# EAGLE design zasilacz v2 (EAGLE 9.6.2)
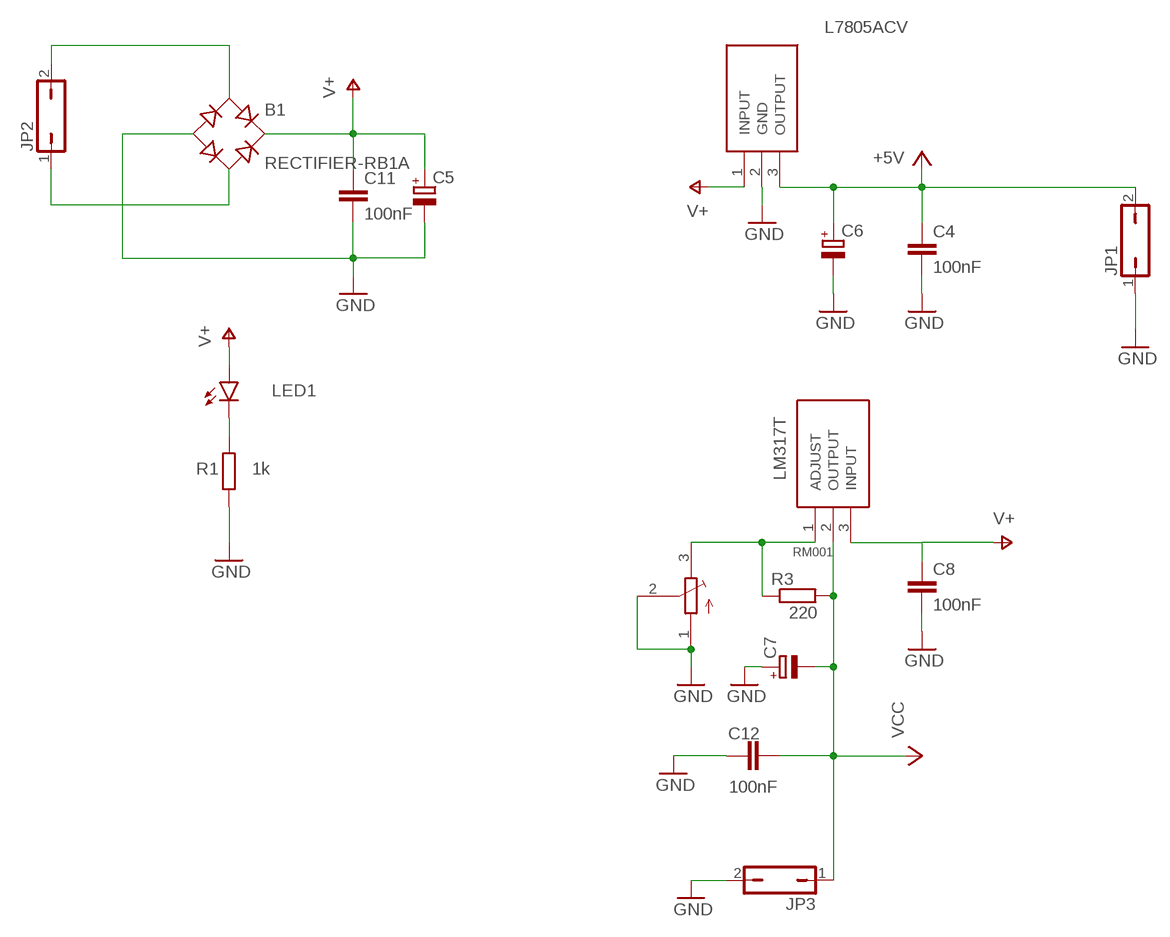
[diagram p0: schematic, sheet 1]

## Parts
,1  LM317T  [TO255P460X1020X2008-3P]
B1  RECTIFIER-RB1A  [RB1A]
C4  100nF  C-EU025-024X044  [C025-024X044]
C5  CPOL-EUE5-10.5  [E5-10,5]
C6  CPOL-EUE5-10.5  [E5-10,5]
C7  CPOL-EUE5-10.5  [E5-10,5]
C8  100nF  C-EU025-024X044  [C025-024X044]
C11  100nF  C-EU025-024X044  [C025-024X044]
C12  100nF  C-EU025-024X044  [C025-024X044]
IC1  L7805ACV  [TO255P460X1020X2008-3P]
JP1  JP1Q  [JP1]
JP2  JP1Q  [JP1]
JP3  JP1Q  [JP1]
LED1  TLLG4400  [LED3MM]
R1  1k  R-EU_0204/5  [0204/5]
R3  220  R-EU_0204/5  [0204/5]
RM001  RM065  [RM065]

## Nets
+5V: C4.1 C6.+ IC1.3(OUTPUT) JP1.2
GND: B1.- C4.2 C5.- C6.- C7.+ C8.2 C11.2 C12.1 IC1.2(GND) JP1.1 JP3.2 R1.1 RM001.1 RM001.2
N$1: LED1.K(C) R1.2
N$3: ,1.1(ADJUST) R3.1 RM001.3
N$5: B1.AC2 JP2.1
N$6: B1.AC1 JP2.2
V+: ,1.3(INPUT) B1.+ C5.+ C8.1 C11.1 IC1.1(INPUT) LED1.A
VCC: ,1.2(OUTPUT) C7.- C12.2 JP3.1 R3.2

## Library data of the parts
,1 = LM317T:LM317T: Standard Regulator 1.2V to 37V 1.5A STMicroelectronics LM317T, Single Linear Voltage Regulator, 1.5A Adjustable 1.2 37 V, 3-Pin TO-220 Source: Datasheet <http://www.st.com/web/en/resource/technical/document/datasheet/CD00000455.pdf>; DESCRIPTION: Standard Regulator 1.2V to 37V 1.5A STMicroelectronics LM317T, Single Linear Voltage Regulator, 1.5A Adjustable 1.2 37 V, 3-Pin TO-220; HEIGHT: 4.6mm; MANUFACTURER_NAME: STMicroelectronics; MANUFACTURER_PART_NUMBER: LM317T; MOUSER_PART_NUMBER: 511-LM317T; MOUSER_PRICE-STOCK: https://www.mouser.co.uk/ProductDetail/STMicroelectronics/LM317T?qs=swDD%252BF%252Bps7c8uLyY%252B3mJJw%3D%3D
B1 = rectifier:RECTIFIER-: Rectifier
C4 C8 C11 C12 = rcl:C-EU: CAPACITOR, European symbol; SPICEPREFIX: C
C5-C7 = rcl:CPOL-EU: POLARIZED CAPACITOR, European symbol; SPICEPREFIX: C
IC1 = L7805ACV:L7805ACV: Linear voltage regulator,L7805ACV 5V 1A STMicroelectronics L7805ACV, Single Linear Voltage Regulator, 1A 5 V, 2%, 3-Pin TO-220 Source: Datasheet <http://www.st.com/web/en/resource/technical/document/datasheet/CD00000444.pdf>; DESCRIPTION: Linear voltage regulator,L7805ACV 5V 1A STMicroelectronics L7805ACV, Single Linear Voltage Regulator, 1A 5 V, 2%, 3-Pin TO-220; HEIGHT: 4.6mm; MANUFACTURER_NAME: STMicroelectronics; MANUFACTURER_PART_NUMBER: L7805ACV; MOUSER_PART_NUMBER: 511-L7805ACV; MOUSER_PRICE-STOCK: https://www.mouser.co.uk/ProductDetail/STMicroelectronics/L7805ACV?qs=xv3lWMc77RdYd2PeLwOwYw%3D%3D
JP1-JP3 = jumper:JP1Q: JUMPER
LED1 = led:TLLG4400: Low Current (2mA) LED 3 mm Tinted Diffused Package color GREEN Source: Data sheet <http://www.farnell.com/datasheets/391098.pdf>; MF: VISHAY SEMICONDUCTOR; OC_FARNELL: 1612435
R1 R3 = rcl:R-EU_: RESISTOR, European symbol; SPICEPREFIX: R
RM001 = RM065:RM065: Trimpot Varable resistor Reference: http://www.runtron.com/down/PDF%20Datasheet/Carbon%20Film%20Potentiometer/RM065%20RM063.pdf Check availability <https://pricing.snapeda.com/parts/RM-065/Vishay/view-part?ref=eda>; AVAILABILITY: Not in stock; DESCRIPTION: Circuit Breaker Thermal 6.5A 240V AC 60V DC Rocker Panel Mount, Snap-In; MF: Vishay; MP: RM-065; PACKAGE: None; PRICE: None

## Board
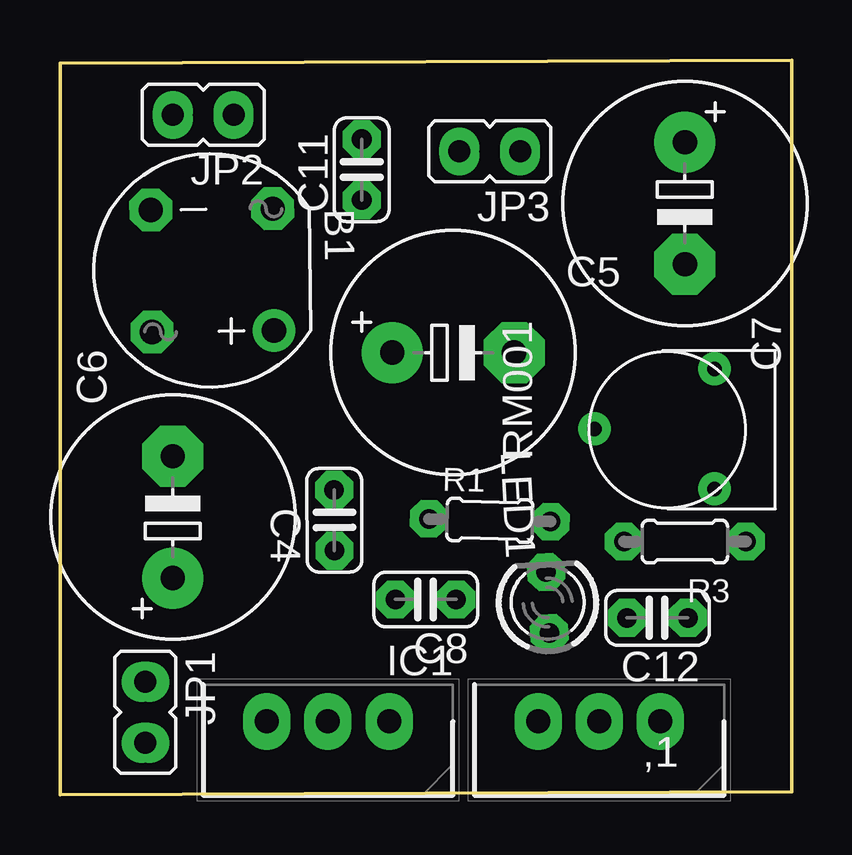
[diagram p1: board, top side]
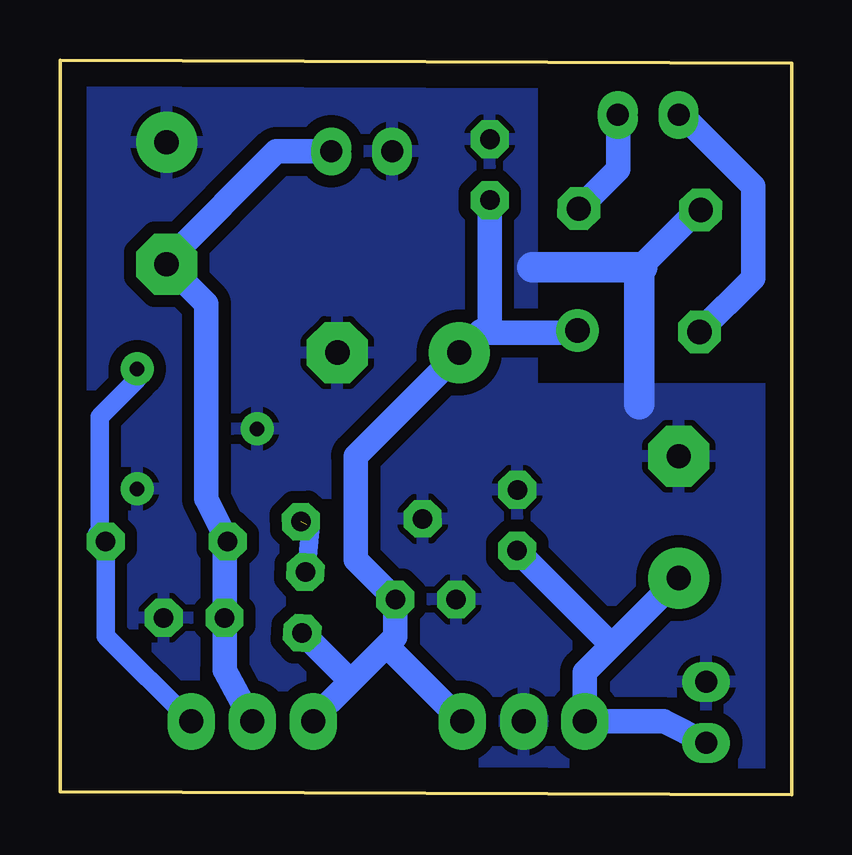
[diagram p2: board, bottom side, seen from below]

Size 30.48 x 30.61 mm. Coordinates in mm from the lower left corner, seen from the top.
Outline: 0,30.48 0,0 30.48,0.13 30.48,30.61 0,30.48
Copper layers (1*16): Top 0.035mm / dielectric 1.5mm / Bottom 0.035mm
Design rules "default *": minimum track width 20mil, minimum drill 0.7mm, track to track 20mil, track to pad 20mil, pad to pad 20mil, via to via 20mil, smd to smd 6mil, copper to edge 40mil, drill to drill 6mil, minimum pad ring 15mil, minimum via ring 15mil, stop-mask expansion 4mil, vias tented up to drill 0mil, thermal gap 10mil

### Footprints (pad centres in the part's own frame; a part is rotated, then mirrored left to right if it is on the bottom)
TO255P460X1020X2008-3P = drill 1 pad 1.98 long: 1 0,0; 2 2.55,0; 3 5.1,0
RB1A = drill 1.016: + -2.54,2.54 | drill 1.016 octagon: - 2.54,-2.54; AC1 2.54,2.54; AC2 -2.54,-2.54
C025-024X044 = drill 0.813 octagon: 1 -1.27,0; 2 1.27,0
E5-10,5 = drill 1.016 pad 2.54: + -2.54,0 | drill 1.016 pad 2.54 octagon: - 2.54,0
JP1 = drill 0.914 long: 1 0,-1.27; 2 0,1.27
LED3MM = drill 0.813 octagon: A -1.27,0; K 1.27,0
0204/5 = drill 0.813 octagon: 1 -2.54,0; 2 2.54,0
RM065 = drill 0.6: 1 -2.5,-2.5; 2 0,2.5; 3 2.5,-2.5

### Placement (x,y rotation side)
,1  25.02,3.05 180 top
B1  6.35,21.84 180.6 top
C4  11.43,11.43 90.2 top
C5  16.38,18.41 0 top
C6  4.7,11.56 90 top
C7  26.03,24.64 270 top
C8  15.24,8.13 180 top
C11  12.57,26.04 90 top
C12  24.89,7.37 180 top
IC1  13.72,3.05 180 top
JP1  3.56,3.43 180 top
JP2  5.97,28.32 90 top
JP3  17.91,26.8 90 top
LED1  20.32,8 93 top
R1  17.91,11.43 358.6 top
R3  26.03,10.54 180 top
RM001  24.77,15.24 90 top

### Tracks (layer width: path | path; a pad name or v marks a point on that pad's centre or on a via)
+5V
  Bottom 1.016: IC1.3 5.33,3.05 JP1.2 | C4.1 7.49,6.22 | IC1.3 8.51,3.15 | C6.+ 7.49,6.22 | 7.49,6.22 8.62,5.1 IC1.3
GND
  Bottom 1.016: B1.- 3.91,24.36 6.22,22.05 6.22,21.97
  Bottom 1.27: 6.35,21.97 6.35,16.26 | 6.22,21.97 6.35,21.97 | 6.35,21.97 9.44,21.97 10.03,21.97 10.79,21.97
  pour Bottom: 0,16.89 10.79,16.89 10.79,29.72 11.43,30.35 30.35,30.35 30.35,1.02 31.24,0.13 0,0.13
N$1  (1 unrouted)
  Bottom 0.508: 20.19,11.24 20.03,11.24 | LED1.K 20.2,9.52
  Bottom 0.762: 20.2,9.52 20.03,11.24
N$3
  Bottom 0.508: RM001.3 27.27,17.31
  Bottom 0.762: 27.27,17.31 28.83,15.75 28.83,10.79 | ,1.1 28.57,6.6 R3.1
  Bottom 1.016: R3.1 28.83,10.79
N$5
  Bottom 1.016: JP2.1 7.21,28.29 7.21,26.06 B1.AC2
N$6
  Bottom 1.016: JP2.2 4.57,28.32 1.6,25.35 1.6,21.51 B1.AC1
V+
  Bottom 0.508: LED1.A 20.37,6.98 | 12.95,19.3 12.57,19.68 | C5.+ 13.82,18.41 | 9.01,19.24 B1.+ | LED1.A 20.32,6.73 | LED1.A 19.75,6.1 | 16.51,5.84 16.51,6.58 | 18.6,4.94 18.6,4.5
  Bottom 0.762: C5.+ 13.72,18.54
  Bottom 1.016: 20.32,6.67 LED1.A 18.6,4.94 | 20.19,3.32 ,1.3 19.92,3.17 18.6,4.5 16.51,6.58 C8.1 18.16,9.78 18.16,14.1 C5.+ | 12.57,19.68 C11.1 | 13.72,18.54 13.02,19.24 | 13.02,19.24 12.95,19.3 | 13.02,19.24 9.01,19.24 | 13.72,3.17 IC1.1 16.51,5.84
VCC
  Bottom 0.508: 25.91,22.35 C7.-
  Bottom 1.016: ,1.2 23.62,5.19 C12.2 23.62,10.41 R3.2 24.38,12.32 24.38,20.45 C7.- | JP3.1 21.46,26.8 25.91,22.35